# Altium schematic sheet Cover.SchDoc
size A3; ApprovedBy: Dr.Ogr.Uys.Sertaç Savaş; CheckedBy: Dr.Ogr.Uys.Sertaç Savaş; Engineer: Nasıf Can Peltek; DocumentNumber: 1; Revision: -; SheetNumber: 1; SheetTotal: 2; releaseDate: 24.03.2024; changeDate: -; Department: Faculty Of Engineering; Size: A3; projeDescription: N555 Driver Card; fileName: Cover.SchDoc
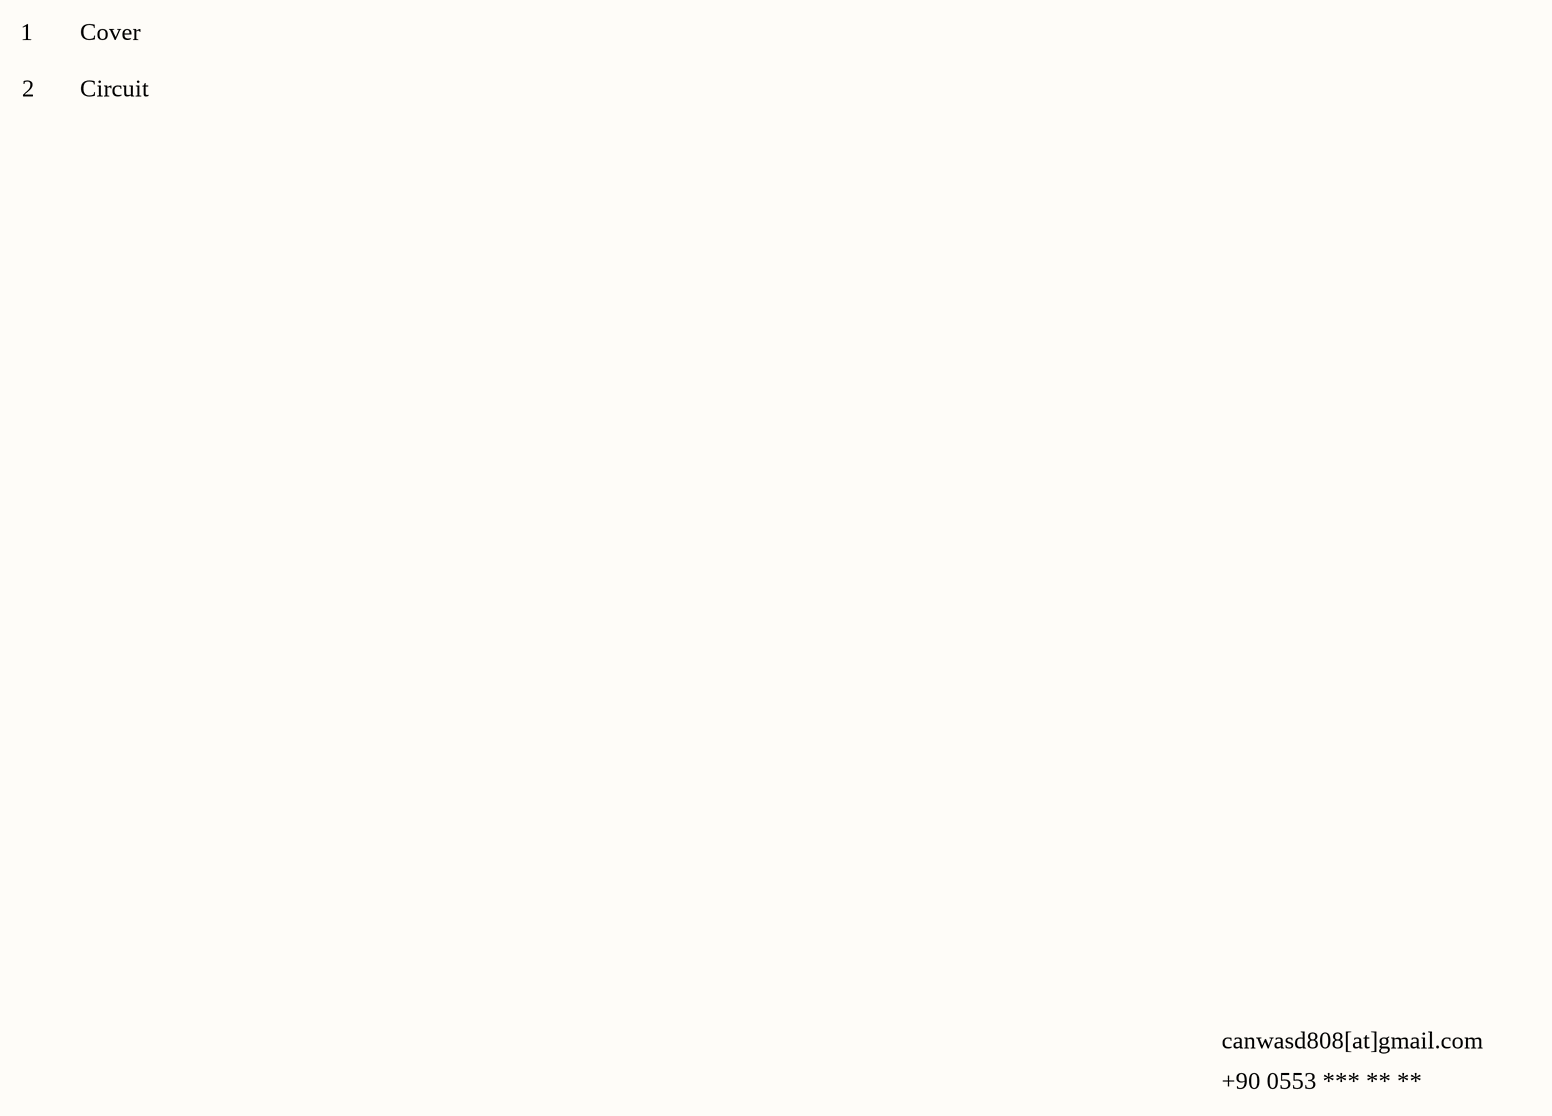
[diagram p0: Cover.SchDoc]

## Notes on the sheet
- 1
- Cover
- 2
- Circuit
- canwasd808[at]gmail.com
- +90 0553 *** ** **
- Page No
- CONTENTS
- Description
- Date
- REVISION
- PRODUCTION NOTES
- Board Function
- Gerber Files
- Attachments
- CONTACT
- FILE NAME
- PREPARED BY
- DESCRIPTION
- RELEASE DATE
- DEPARTMENT
- CHECKED BY
- APPROVED BY
- SIZE
- CHANGE DATE
- SHEET
- /